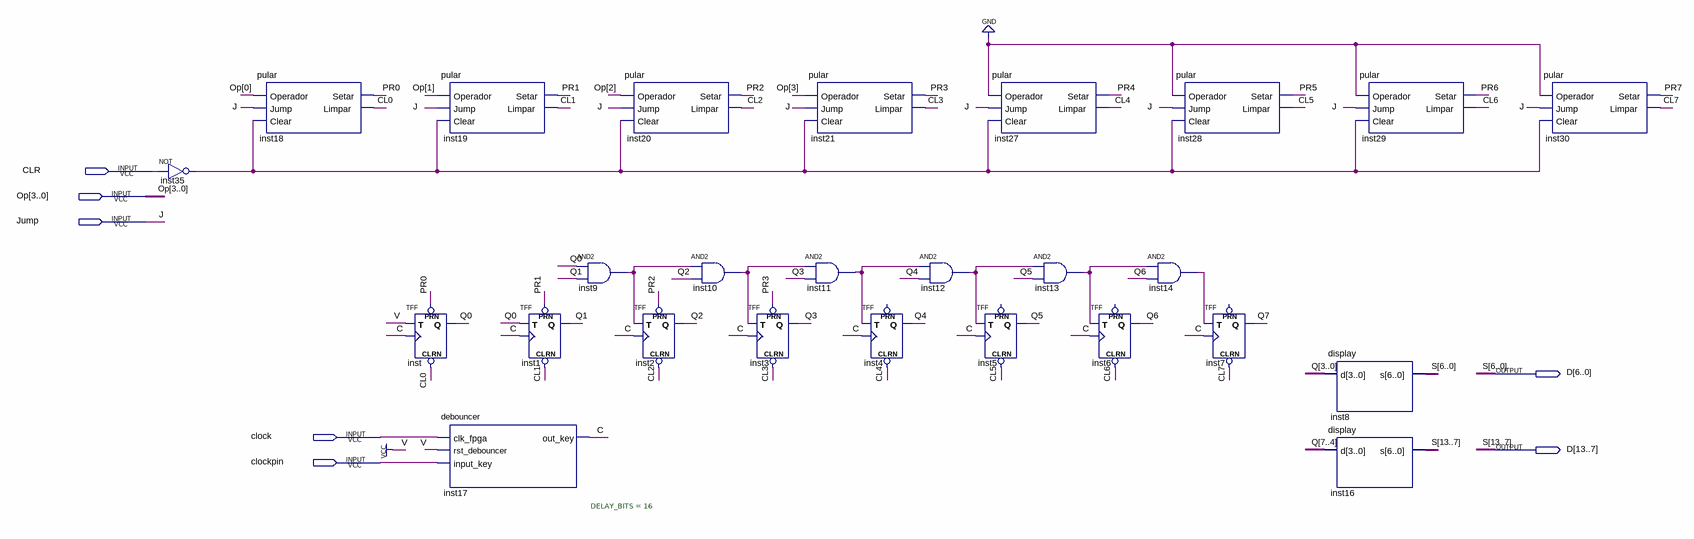
[diagram p0: schematic sheet]
// Quartus schematic contador.bdf as structural Verilog: 26 symbols, 7 pins
module contador (
  input  CLR,
  input  [3:0] Op,
  input  Jump,
  input  clock,
  input  clockpin,
  output [13:0] D
);

  wire C, CL0, CL1, CL2, CL3, CL4, CL5, CL6, CL7, inst9_out, inst10_out, inst11_out, inst12_out, inst13_out,
       inst14_out, inst35_out, PR0, PR1, PR2, PR3, PR4, PR5, PR6, PR7;
  wire [7:0] Q;

  not inst35 (inst35_out, CLR);
  pular inst18 (.Operador(Op[0]), .Jump(Jump), .Clear(inst35_out), .Setar(PR0), .Limpar(CL0));
  TFF inst (.PRN(PR0), .CLRN(CL0), .T(1'b1), .CLK(C), .Q(Q[0]));
  pular inst19 (.Operador(Op[1]), .Jump(Jump), .Clear(inst35_out), .Setar(PR1), .Limpar(CL1));
  debouncer #(.DELAY_BITS(16)) inst17 (.clk_fpga(clock), .rst_debouncer(1'b1), .input_key(clockpin), .out_key(C));
  TFF inst1 (.PRN(PR1), .CLRN(CL1), .T(Q[0]), .CLK(C), .Q(Q[1]));
  and inst9 (inst9_out, Q[0], Q[1]);
  pular inst20 (.Operador(Op[2]), .Jump(Jump), .Clear(inst35_out), .Setar(PR2), .Limpar(CL2));
  TFF inst2 (.PRN(PR2), .CLRN(CL2), .T(inst9_out), .CLK(C), .Q(Q[2]));
  and inst10 (inst10_out, inst9_out, Q[2]);
  TFF inst3 (.PRN(PR3), .CLRN(CL3), .T(inst10_out), .CLK(C), .Q(Q[3]));
  pular inst21 (.Operador(Op[3]), .Jump(Jump), .Clear(inst35_out), .Setar(PR3), .Limpar(CL3));
  and inst11 (inst11_out, inst10_out, Q[3]);
  TFF inst4 (.CLRN(CL4), .T(inst11_out), .CLK(C), .Q(Q[4]));  // open: PRN
  and inst12 (inst12_out, inst11_out, Q[4]);
  TFF inst5 (.CLRN(CL5), .T(inst12_out), .CLK(C), .Q(Q[5]));  // open: PRN
  pular inst27 (.Operador(1'b0), .Jump(Jump), .Clear(inst35_out), .Setar(PR4), .Limpar(CL4));
  and inst13 (inst13_out, inst12_out, Q[5]);
  TFF inst6 (.CLRN(CL6), .T(inst13_out), .CLK(C), .Q(Q[6]));  // open: PRN
  pular inst28 (.Operador(1'b0), .Jump(Jump), .Clear(inst35_out), .Setar(PR5), .Limpar(CL5));
  and inst14 (inst14_out, inst13_out, Q[6]);
  TFF inst7 (.CLRN(CL7), .T(inst14_out), .CLK(C), .Q(Q[7]));  // open: PRN
  display inst8 (.d(Q[3:0]), .s(D[6:0]));
  display inst16 (.d(Q[7:4]), .s(D[13:7]));
  pular inst29 (.Operador(1'b0), .Jump(Jump), .Clear(inst35_out), .Setar(PR6), .Limpar(CL6));
  pular inst30 (.Operador(1'b0), .Jump(Jump), .Clear(inst35_out), .Setar(PR7), .Limpar(CL7));

  // Other names for the same wires on the sheet: J = Jump; S[13:0] = D
endmodule
